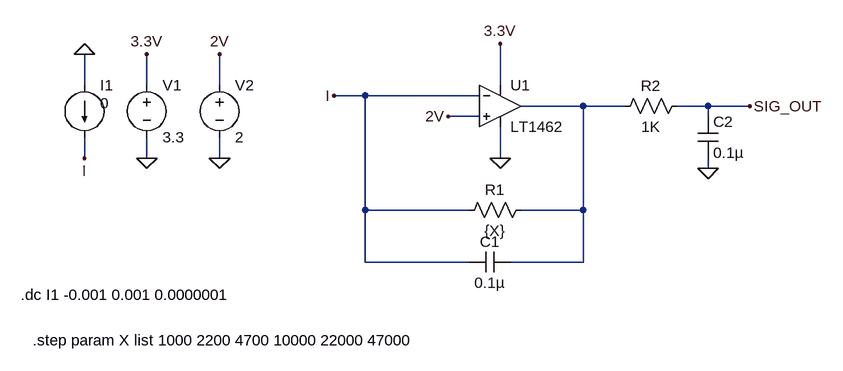
[diagram p0: schematic Trans Amp LT1462.asc]
Trans Amp LT1462.asc, the LTspice schematic file:
Version 4
SHEET 1 892 680
WIRE -256 -128 -256 -176
WIRE -160 -128 -160 -176
WIRE -48 -128 -48 -176
WIRE 384 -128 384 -192
WIRE 176 -112 128 -112
WIRE 352 -112 176 -112
WIRE 512 -96 416 -96
WIRE 576 -96 512 -96
WIRE 704 -96 656 -96
WIRE 768 -96 704 -96
WIRE 352 -80 304 -80
WIRE 704 -80 704 -96
WIRE -256 -16 -256 -48
WIRE -160 -16 -160 -48
WIRE -48 -16 -48 -48
WIRE 384 -16 384 -64
WIRE 704 0 704 -16
WIRE 176 64 176 -112
WIRE 336 64 176 64
WIRE 512 64 512 -96
WIRE 512 64 416 64
WIRE 176 144 176 64
WIRE 336 144 176 144
WIRE 512 144 512 64
WIRE 512 144 400 144
FLAG -160 -16 0
FLAG -48 -16 0
FLAG -48 -176 2V
FLAG -160 -176 3.3V
FLAG 384 -192 3.3V
FLAG 384 -16 0
FLAG 304 -80 2V
FLAG -256 -16 I
FLAG 128 -112 I
FLAG 704 0 0
FLAG 768 -96 SIG_OUT
FLAG -256 -176 0
SYMBOL voltage -160 -144 R0
WINDOW 123 0 0 Left 0
WINDOW 39 0 0 Left 0
SYMATTR InstName V1
SYMATTR Value 3.3
SYMBOL voltage -48 -144 R0
WINDOW 123 0 0 Left 0
WINDOW 39 0 0 Left 0
SYMATTR InstName V2
SYMATTR Value 2
SYMBOL OpAmps\\LT1462 384 -160 R0
SYMATTR InstName U1
SYMBOL current -256 -128 R0
WINDOW 3 24 28 Left 2
WINDOW 123 0 0 Left 0
WINDOW 39 0 0 Left 0
SYMATTR InstName I1
SYMATTR Value 0
SYMBOL res 432 48 R90
WINDOW 0 0 56 VBottom 2
WINDOW 3 32 56 VTop 2
SYMATTR InstName R1
SYMATTR Value {X}
SYMATTR SpiceLine tol=1 pwr=0.1
SYMBOL cap 400 128 R90
WINDOW 0 0 32 VBottom 2
WINDOW 3 32 32 VTop 2
SYMATTR InstName C1
SYMATTR Value 0.1µ
SYMATTR SpiceLine V=4 Irms=0 Rser=0 Lser=0 mfg="Murata" pn="GRM022R60G153KE15" type="X5R"
SYMBOL res 672 -112 R90
WINDOW 0 0 56 VBottom 2
WINDOW 3 32 56 VTop 2
SYMATTR InstName R2
SYMATTR Value 1K
SYMATTR SpiceLine tol=1 pwr=0.1
SYMBOL cap 688 -80 R0
SYMATTR InstName C2
SYMATTR Value 0.1µ
SYMATTR SpiceLine V=4 Irms=0 Rser=0 Lser=0 mfg="Murata" pn="GRM022R60G153KE15" type="X5R"
TEXT -354 194 Left 2 !.dc I1 -0.001 0.001 0.0000001
TEXT -336 264 Left 2 !.step param X list 1000 2200 4700 10000 22000 47000

The netlist it stands for:
* Trans Amp LT1462.asc
V1 3.3V 0 3.3
V2 2V 0 2
XU1 2V I 3.3V 0 N001 LT1462  ; pins In+ In- V+ V- OUT
I1 0 I 0
R1 N001 I {X} tol=1 pwr=0.1
C1 N001 I 0.1µ V=4 Irms=0 Rser=0 Lser=0 mfg="Murata" pn="GRM022R60G153KE15" type="X5R"
R2 SIG_OUT N001 1K tol=1 pwr=0.1
C2 SIG_OUT 0 0.1µ V=4 Irms=0 Rser=0 Lser=0 mfg="Murata" pn="GRM022R60G153KE15" type="X5R"
.dc I1 -0.001 0.001 0.0000001
.step param X list 1000 2200 4700 10000 22000 47000
.lib LTC.lib
.backanno
.end